# EAGLE design Rev A (Daughter Board) (EAGLE 9.6.2)
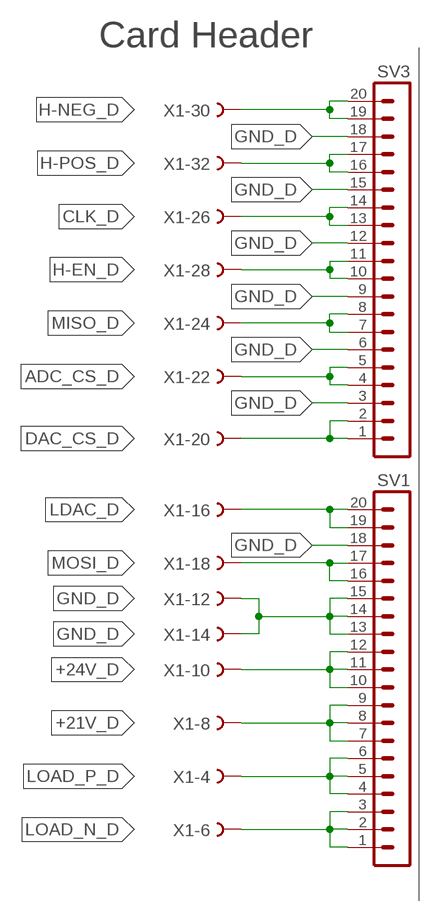
[diagram p0: schematic, sheet 1]

## Parts
SV1  MA20-1  [MA20-1]
SV3  MA20-1  [MA20-1]
X1  FH15  [FH15]

## Nets
+21V_D: SV1.7 SV1.8 SV1.9 X1.8
+24V_D: SV1.10 SV1.11 SV1.12 X1.10
ADC_CS_D: SV3.4 SV3.5 X1.22
CLK_D: SV3.13 SV3.14 X1.26
DAC_CS_D: SV3.1 SV3.2 X1.20
GND_D: SV1.13 SV1.14 SV1.15 SV1.18 SV3.3 SV3.6 SV3.9 SV3.12 SV3.15 SV3.18 X1.12 X1.14
H-EN_D: SV3.10 SV3.11 X1.28
H-NEG_D: SV3.19 SV3.20 X1.30
H-POS_D: SV3.16 SV3.17 X1.32
LDAC_D: SV1.19 SV1.20 X1.16
LOAD_N_D: SV1.1 SV1.2 SV1.3 X1.6
LOAD_P_D: SV1.4 SV1.5 SV1.6 X1.4
MISO_D: SV3.7 SV3.8 X1.24
MOSI_D: SV1.16 SV1.17 X1.18

## Notes on the sheet
- Card Header

## Library data of the parts
SV1 SV3 = con-lstb:MA20-1: PIN HEADER; OC_FARNELL: unknown; OC_NEWARK: unknown
X1 = con-vg:FH15: CONNECTOR female, 15 pins, type H, rows DZ

## Board
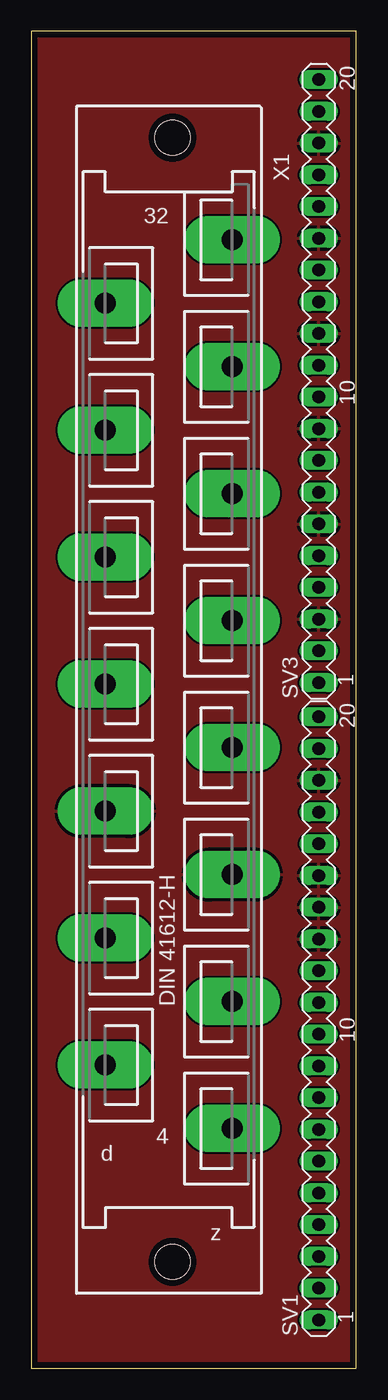
[diagram p1: board, top side]
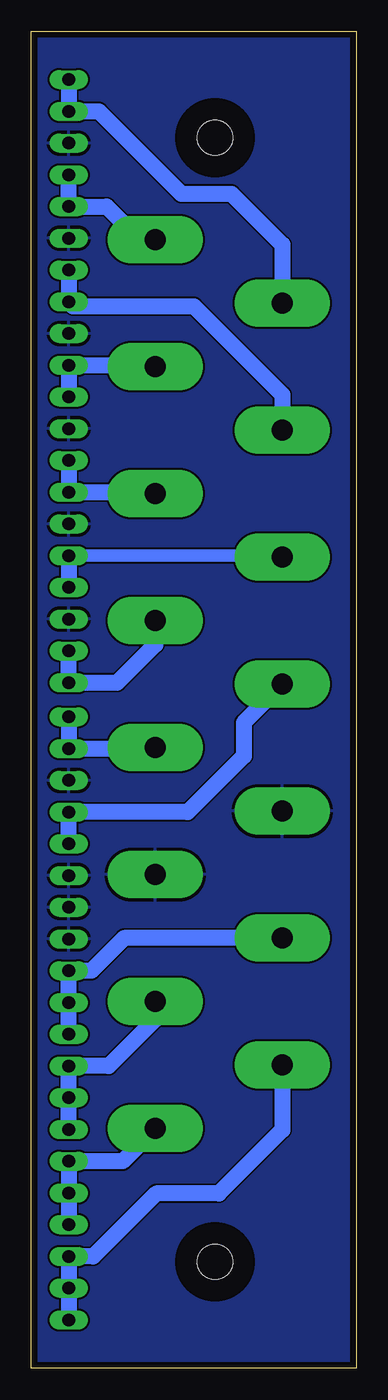
[diagram p2: board, bottom side, seen from below]

Size 26 x 107 mm. Coordinates in mm from the lower left corner, seen from the top.
Outline: 0,0 26,0 26,107 0,107 0,0
Copper layers (1*16): Top 0.035mm / dielectric 1.5mm / Bottom 0.035mm
Design rules "default *": minimum track width 6mil, minimum drill 0.35mm, track to track 6mil, track to pad 6mil, pad to pad 6mil, via to via 6mil, smd to smd 6mil, copper to edge 20mil, drill to drill 6mil, minimum pad ring 10mil, minimum via ring 8mil, stop-mask expansion 4mil, vias tented up to drill 0mil, thermal gap 10mil

### Footprints (pad centres in the part's own frame; a part is rotated, then mirrored left to right if it is on the bottom)
MA20-1 = drill 1.016 long: 1 -24.13,0; 2 -21.59,0; 3 -19.05,0; 4 -16.51,0; 5 -13.97,0; 6 -11.43,0; 7 -8.89,0; 8 -6.35,0; 9 -3.81,0; 10 -1.27,0; 11 1.27,0; 12 3.81,0; 13 6.35,0; 14 8.89,0; 15 11.43,0; 16 13.97,0; 17 16.51,0; 18 19.05,0; 19 21.59,0; 20 24.13,0
FH15 = drill 1.676 pad 3.81 long: 4 -5.08,34.315; 6 5.08,29.235; 8 -5.08,24.155; 10 5.08,19.075; 12 -5.08,13.995; 14 5.08,8.915; 16 -5.08,3.835; 18 5.08,-1.245; 20 -5.08,-6.325; 22 5.08,-11.405; 24 -5.08,-16.485; 26 5.08,-21.565; 28 -5.08,-26.645; 30 5.08,-31.725; 32 -5.08,-36.805 | hole 2.794: -0.305,44.983; -0.305,-44.983

### Placement (x,y rotation side)
SV1  23,28 90 top
SV3  23,79 90 top
X1  11,53.5 180 top

### Tracks (layer width: path | path; a pad name or v marks a point on that pad's centre or on a via)
+21V_D
  Bottom 1.27: SV1.7 SV1.8 SV1.9 19.81,24.19 16.08,27.92 X1.8
+24V_D
  Bottom 1.27: SV1.10 SV1.11 SV1.12 21.19,31.81 18.57,34.42 X1.10
ADC_CS_D
  Bottom 1.016: X1.22 6.04,65.03 SV3.5
  Bottom 1.27: SV3.5 SV3.4
CLK_D
  Bottom 1.27: SV3.14 SV3.13 22.65,85 13,85 5.92,77.92 X1.26
DAC_CS_D
  Bottom 1.27: SV3.2 SV3.1 19.13,54.87 16.08,57.92 X1.20
GND_D
  pour Top: -1,-1 26,-1 26,107 -1,107
  pour Bottom: -2,-1 26,-1 26,108 -2,108
H-EN_D
  Bottom 1.27: SV3.10 SV3.11 16.2,80.27 X1.28
H-NEG_D
  Bottom 1.27: SV3.20 SV3.19 20.59,100.59 14,94 10,94 5.92,89.92 X1.30
H-POS_D
  Bottom 1.27: SV3.17 SV3.16 19.97,92.97 17.3,90.31 X1.32
LDAC_D
  Bottom 1.27: SV1.20 SV1.19 16.16,49.59 X1.16
LOAD_N_D
  Bottom 1.27: X1.6 5.92,19.08 11,14 16,14 21.05,8.95 SV1.3 SV1.2 SV1.1
LOAD_P_D
  Bottom 1.27: X1.4 18.7,16.57 SV1.6 SV1.5 SV1.4
MISO_D
  Bottom 1.27: SV3.8 SV3.7 16.2,70.11 X1.24
MOSI_D
  Bottom 1.27: SV1.16 SV1.17 13.49,44.51 9,49 9,51.66 X1.18